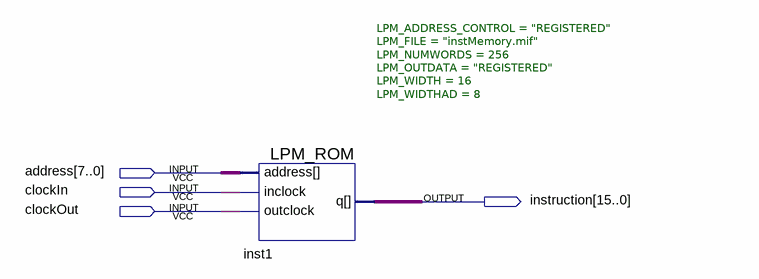
[diagram p0: schematic sheet]
// Quartus schematic iCache.bdf as structural Verilog: 1 symbols, 4 pins
module iCache (
  input  [7:0] address,
  input  clockIn,
  input  clockOut,
  output [15:0] instruction
);

  LPM_ROM #(.LPM_ADDRESS_CONTROL("REGISTERED"), .LPM_FILE("instMemory.mif"), .LPM_NUMWORDS(256), .LPM_OUTDATA("REGISTERED"), .LPM_WIDTH(16), .LPM_WIDTHAD(8)) inst1 (
    .address(address), .inclock(clockIn), .outclock(clockOut), .q(instruction));
endmodule
